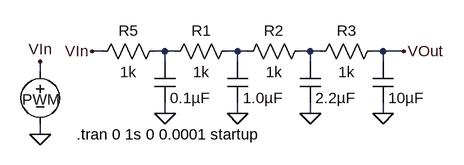
[diagram p0: schematic lopass4.asc]
lopass4.asc, the LTspice schematic file:
Version 4
SHEET 1 1316 680
WIRE -560 -16 -576 -16
WIRE -464 -16 -480 -16
WIRE -448 -16 -464 -16
WIRE -352 -16 -368 -16
WIRE -336 -16 -352 -16
WIRE -240 -16 -256 -16
WIRE -224 -16 -240 -16
WIRE -128 -16 -144 -16
WIRE -96 -16 -128 -16
WIRE -464 0 -464 -16
WIRE -352 0 -352 -16
WIRE -240 0 -240 -16
WIRE -128 0 -128 -16
WIRE -656 16 -656 0
WIRE -464 80 -464 64
WIRE -352 80 -352 64
WIRE -240 80 -240 64
WIRE -128 80 -128 64
WIRE -656 112 -656 96
FLAG -656 0 VIn
FLAG -656 112 0
FLAG -576 -16 VIn
FLAG -464 80 0
FLAG -352 80 0
FLAG -240 80 0
FLAG -96 -16 VOut
FLAG -128 80 0
SYMBOL voltage -656 0 R0
WINDOW 0 -28 58 Left 2
WINDOW 3 24 96 Invisible 2
WINDOW 123 0 0 Left 2
WINDOW 39 0 0 Left 2
SYMATTR InstName PWM
SYMATTR Value PULSE(0 5 0 0.01ms 0.01ms 1.020ms 2.040ms)
SYMBOL res -464 -32 R90
WINDOW 0 0 56 VBottom 2
WINDOW 3 32 56 VTop 2
SYMATTR InstName R5
SYMATTR Value 1k
SYMBOL cap -480 0 R0
WINDOW 0 24 8 Invisible 2
SYMATTR InstName C5
SYMATTR Value 0.1µF
SYMBOL res -352 -32 R90
WINDOW 0 0 56 VBottom 2
WINDOW 3 32 56 VTop 2
SYMATTR InstName R1
SYMATTR Value 1k
SYMBOL cap -368 0 R0
WINDOW 0 24 8 Invisible 2
SYMATTR InstName C1
SYMATTR Value 1.0µF
SYMBOL res -240 -32 R90
WINDOW 0 0 56 VBottom 2
WINDOW 3 32 56 VTop 2
SYMATTR InstName R2
SYMATTR Value 1k
SYMBOL cap -256 0 R0
WINDOW 0 24 8 Invisible 2
SYMATTR InstName C2
SYMATTR Value 2.2µF
SYMBOL res -128 -32 R90
WINDOW 0 0 56 VBottom 2
WINDOW 3 32 56 VTop 2
SYMATTR InstName R3
SYMATTR Value 1k
SYMBOL cap -144 0 R0
WINDOW 0 24 8 Invisible 2
SYMATTR InstName C3
SYMATTR Value 10µF
TEXT -600 112 Left 2 !.tran 0 1s 0 0.0001 startup

The netlist it stands for:
* lopass4.asc
V§PWM VIn 0 PULSE(0 5 0 0.01ms 0.01ms 1.020ms 2.040ms)
R5 N001 VIn 1k
C5 N001 0 0.1µF
R1 N002 N001 1k
C1 N002 0 1.0µF
R2 N003 N002 1k
C2 N003 0 2.2µF
R3 VOut N003 1k
C3 VOut 0 10µF
.tran 0 1s 0 0.0001 startup
.backanno
.end